# Altium schematic sheet w5500.SchDoc
size A4
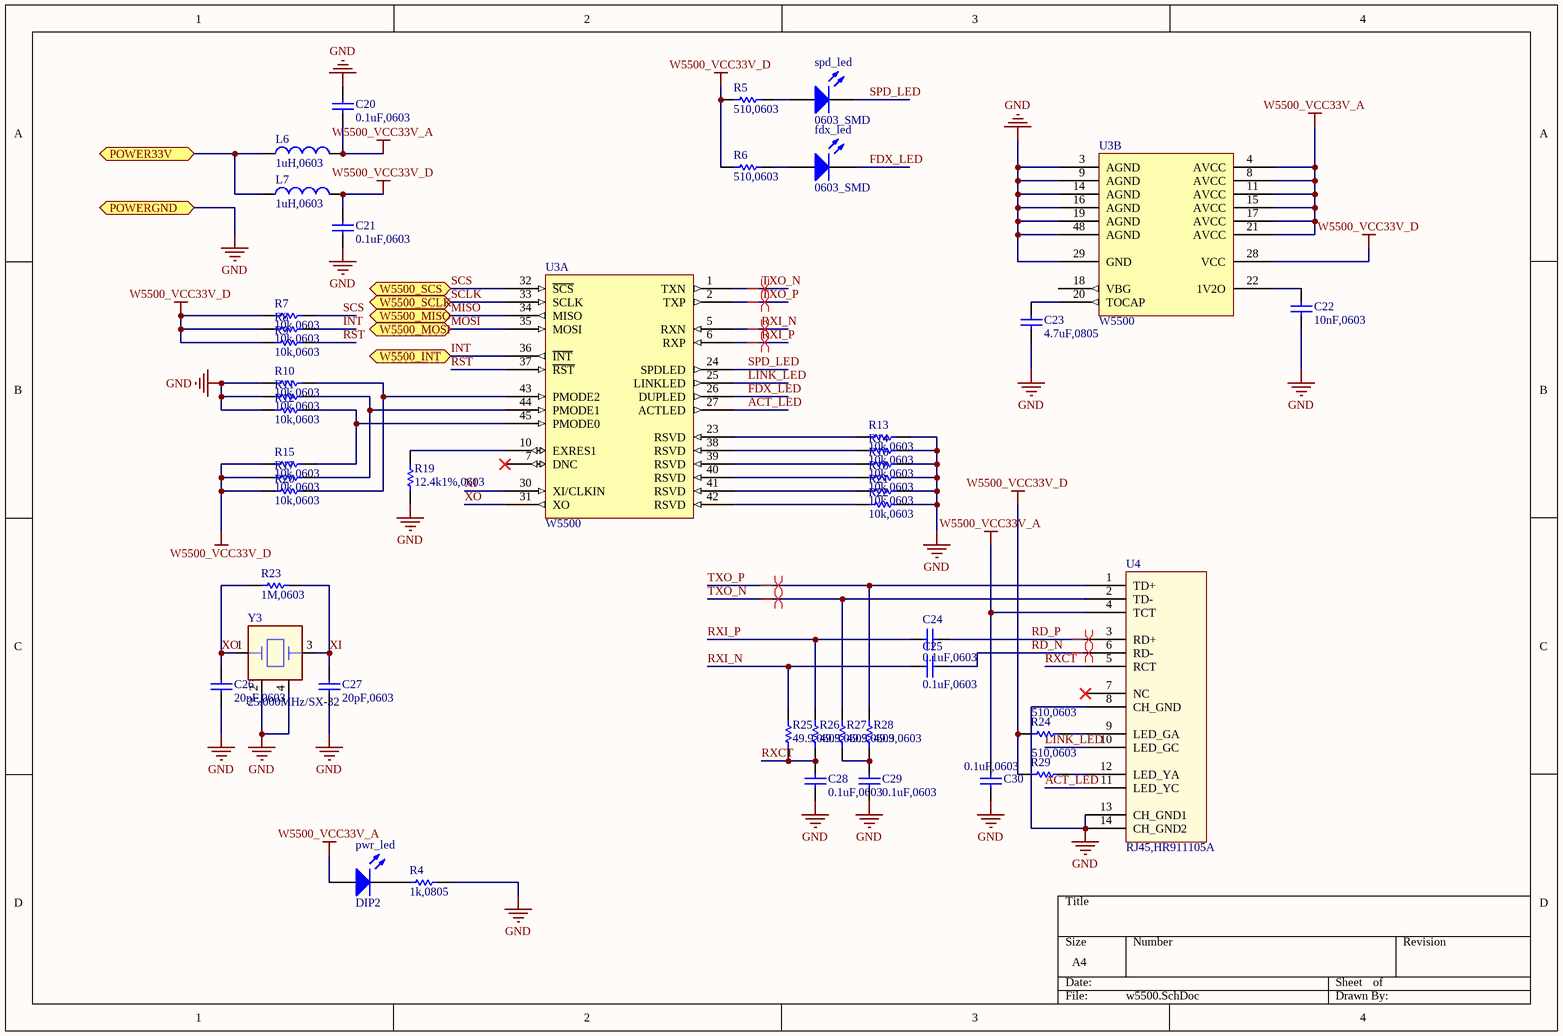
[diagram p0: w5500.SchDoc]

## Parts
C20  0.1uF,0603  [C0603]
C21  0.1uF,0603  [C0603]
C22  10nF,0603  [C0603]
C23  4.7uF,0805  [C0805]
C24  0.1uF,0603  [C0603]
C25  0.1uF,0603  [C0603]
C26  20pF,0603  [C0603]
C27  20pF,0603  [C0603]
C28  0.1uF,0603  [C0603]
C29  0.1uF,0603  [C0603]
C30  0.1uF,0603  [C0603]
fdx_led  0603_SMD  [LED0805]
L6  1uH,0603  [L0603]
L7  1uH,0603  [L0603]
pwr_led  DIP2  [LEDDIP2]
R4  1k,0805  [R0805]
R5  510,0603  [R0603]
R6  510,0603  [R0603]
R7  10k,0603  [R0603]
R8  10k,0603  [R0603]
R9  10k,0603  [R0603]
R10  10k,0603  [R0603]
R11  10k,0603  [R0603]
R12  10k,0603  [R0603]
R13  10k,0603  [R0603]
R14  10k,0603  [R0603]
R15  10k,0603  [R0603]
R16  10k,0603  [R0603]
R17  10k,0603  [R0603]
R18  10k,0603  [R0603]
R19  12.4k1%,0603  [R0603]
R20  10k,0603  [R0603]
R21  10k,0603  [R0603]
R22  10k,0603  [R0603]
R23  1M,0603  [R0603]
R24  510,0603  [R0603]
R25  49.9,0603  [R0603]
R26  49.9,0603  [R0603]
R27  49.9,0603  [R0603]
R28  49.9,0603  [R0603]
R29  510,0603  [R0603]
spd_led  0603_SMD  [LED0805]
U3  W5500  [LQFP48]  (parts A,B of 2)
U4  RJ45,HR911105A  [RJ45]
Y3  25.000MHz/SX-32  [3225]

## Ports
POWER33V, POWERGND, W5500_INT, W5500_MISO, W5500_MOSI, W5500_SCLK, W5500_SCS

## Nets
GND: C20.2 C21.1 C22.1 C23.1 C26.2 C27.2 C28.1 C29.2 C30.1 R4.2 R10.1 R11.1 R12.1 R13.2 R14.2 R16.2 R18.2 R19.1 R21.2 R22.2 U3.3(AGND) U3.9(AGND) U3.14(AGND) U3.16(AGND) U3.19(AGND) U3.29(GND) U3.48(AGND) U4.8(CH_GND) U4.13(CH_GND1) U4.14(CH_GND2) Y3.2 Y3.4 ; port POWERGND
W5500_VCC33V_A: C20.1 C30.2 L6.2 pwr_led.1(A) U3.4(AVCC) U3.8(AVCC) U3.11(AVCC) U3.15(AVCC) U3.17(AVCC) U3.21(AVCC) U4.4(TCT)
W5500_VCC33V_D: C21.2 L7.2 R5.1 R6.1 R7.1 R8.1 R9.1 R15.1 R17.1 R20.1 R24.1 R29.1 U3.28(VCC)
ACT_LED: U3.27(ACTLED) U4.11(LED_YC)
FDX_LED: fdx_led.2(K) U3.26(DUPLED)
INT: R8.2 U3.36(~{INT}) ; port W5500_INT
LINK_LED: U3.25(LINKLED) U4.10(LED_GC)
MISO: U3.34(MISO) ; port W5500_MISO
MOSI: U3.35(MOSI) ; port W5500_MOSI
POWER33V: L6.1 L7.1 ; port POWER33V
RD_N: C25.2 U4.6(RD-)
RD_P: C24.2 U4.3(RD+)
RST: R9.2 U3.37(~{RST})
RXCT: C28.2 R25.1 R26.2 U4.5(RCT)
RXI_N: C25.1 R25.2 U3.5(RXN)
RXI_P: C24.1 R26.1 U3.6(RXP)
SCLK: U3.33(SCLK) ; port W5500_SCLK
SCS: R7.2 U3.32(~{SCS}) ; port W5500_SCS
SPD_LED: spd_led.2(K) U3.24(SPDLED)
TXO_N: R27.1 U3.1(TXN) U4.2(TD-)
TXO_P: R28.1 U3.2(TXP) U4.1(TD+)
XI: C27.1 R23.2 U3.30(XI/CLKIN) Y3.3
XO: C26.1 R23.1 U3.31(XO) Y3.1
NetC22_2: C22.2 U3.22(1V2O)
NetC23_2: C23.2 U3.20(TOCAP)
NetC29_1: C29.1 R27.2 R28.2
Netfdx_led_1: fdx_led.1(A) R6.2
Netpwr_led_2: pwr_led.2(K) R4.1
NetR5_2: R5.2 spd_led.1(A)
NetR10_2: R10.2 R20.2 U3.43(PMODE2)
NetR11_2: R11.2 R17.2 U3.44(PMODE1)
NetR12_2: R12.2 R15.2 U3.45(PMODE0)
NetR13_1: R13.1 U3.23(RSVD)
NetR14_1: R14.1 U3.38(RSVD)
NetR16_1: R16.1 U3.39(RSVD)
NetR18_1: R18.1 U3.40(RSVD)
NetR19_2: R19.2 U3.10(EXRES1)
NetR21_1: R21.1 U3.41(RSVD)
NetR22_1: R22.1 U3.42(RSVD)
NetR24_2: R24.2 U4.9(LED_GA)
NetR29_2: R29.2 U4.12(LED_YA)

Not connected (* = marked no-connect by the designer): U3 7(DNC)* 18(VBG); U4 7(NC)*

## Layout directives
differential pair: RD_N, RD_P, RXI_N, RXI_P, TXO_N, TXO_P

## Library data of the parts
C20-C30 = CAP: Capacitor; Published: 8-Jun-2000; Revision: July-2002: Re-released for DXP Platform.; Publisher: Altium Limited
  C20 C21 C24 C25 C28-C30: Value: 0.1uF
  C22: Value: 10nF
  C23: Value: 4.7uF
  C26 C27: Value: 20pF
fdx_led pwr_led spd_led = LED
L6 L7 = Inductor: Code_IEC: 1005; Published: 8-Jun-2000; LatestRevisionDate: 17-Jul-2002; LatestRevisionNote: Re-released for DXP Platform.; PackageReference: 0402-A; Publisher: Altium Limited; Code_JEITA: 0402; Value: 1uH
R4 R7-R18 R20-R23 = Res1: Resistor; Published: 8-Jun-2000; Revision: July-2002: Re-released for DXP Platform.; Publisher: Altium Limited
  R4: value: 1k
  R7-R18 R20-R22: value: 10k
  R23: value: 1M
R5 R6 R24 R29 = Res1: Resistor; value: 510; Published: 8-Jun-2000; Revision: July-2002: Re-released for DXP Platform.; Publisher: Altium Limited
R19 = Res1: Resistor; value: 12.4k; Published: 8-Jun-2000; Revision: July-2002: Re-released for DXP Platform.; Publisher: Altium Limited
R25-R28 = Res1: Resistor; value: 49.9; Published: 8-Jun-2000; Revision: July-2002: Re-released for DXP Platform.; Publisher: Altium Limited
U4 = HR911105A: pin to pad: 14>13
Y3 = CRYSTAL_5